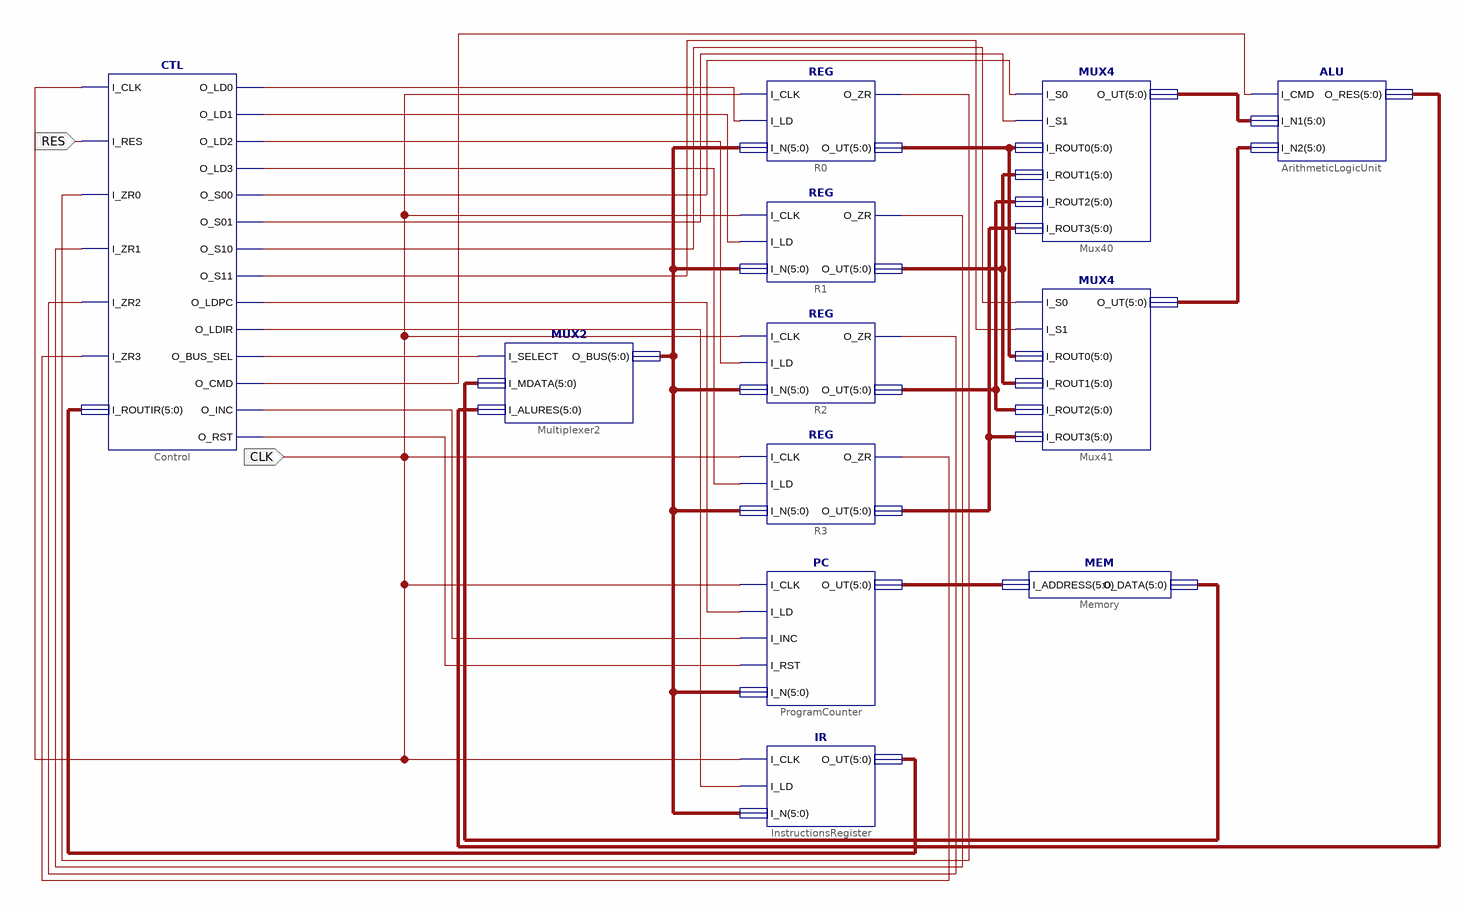
[diagram p0: schematic sheet 1]
// Xilinx ISE schematic Schema.sch (spartan3) as structural Verilog: 12 symbols, 2 ports
module Schema (
  input  CLK,
  input  RES
);

  wire BUS_Sel, CMD, INC, LD0, LD1, LD2, LD3, LDIR, LDPC, RST, S00, S01, S10, S11, ZR0, ZR1, ZR2, ZR3;
  wire [5:0] ALURes, DBUS, MData, MEM_ADDRESS, Mux40out, Mux41out, ROUT0, ROUT1, ROUT2, ROUT3, ROUTIR;

  MUX2 Multiplexer2 (.I_SELECT(BUS_Sel), .I_MDATA(MData), .I_ALURES(ALURes), .O_BUS(DBUS));
  CTL Control (
    .I_CLK(CLK), .I_RES(RES), .I_ZR0(ZR0), .I_ZR1(ZR1), .I_ZR2(ZR2), .I_ZR3(ZR3), .I_ROUTIR(ROUTIR),
    .O_LD0(LD0), .O_LD1(LD1), .O_LD2(LD2), .O_LD3(LD3), .O_S00(S00), .O_S01(S01), .O_S10(S10), .O_S11(S11),
    .O_LDPC(LDPC), .O_LDIR(LDIR), .O_BUS_SEL(BUS_Sel), .O_CMD(CMD), .O_INC(INC), .O_RST(RST));
  PC ProgramCounter (.I_CLK(CLK), .I_LD(LDPC), .I_INC(INC), .I_RST(RST), .I_N(DBUS), .O_UT(MEM_ADDRESS));
  IR InstructionsRegister (.I_CLK(CLK), .I_LD(LDIR), .I_N(DBUS), .O_UT(ROUTIR));
  REG R2 (.I_CLK(CLK), .I_LD(LD2), .I_N(DBUS), .O_ZR(ZR2), .O_UT(ROUT2));
  REG R3 (.I_CLK(CLK), .I_LD(LD3), .I_N(DBUS), .O_ZR(ZR3), .O_UT(ROUT3));
  REG R1 (.I_CLK(CLK), .I_LD(LD1), .I_N(DBUS), .O_ZR(ZR1), .O_UT(ROUT1));
  REG R0 (.I_CLK(CLK), .I_LD(LD0), .I_N(DBUS), .O_ZR(ZR0), .O_UT(ROUT0));
  MUX4 Mux40 (
    .I_S0(S00), .I_S1(S01), .I_ROUT0(ROUT0), .I_ROUT1(ROUT1), .I_ROUT2(ROUT2), .I_ROUT3(ROUT3),
    .O_UT(Mux40out));
  MUX4 Mux41 (
    .I_S0(S10), .I_S1(S11), .I_ROUT0(ROUT0), .I_ROUT1(ROUT1), .I_ROUT2(ROUT2), .I_ROUT3(ROUT3),
    .O_UT(Mux41out));
  ALU ArithmeticLogicUnit (.I_CMD(CMD), .I_N1(Mux40out), .I_N2(Mux41out), .O_RES(ALURes));
  MEM Memory (.I_ADDRESS(MEM_ADDRESS), .O_DATA(MData));
endmodule
